# EAGLE design cgs_subosc (EAGLE 7.1.0)
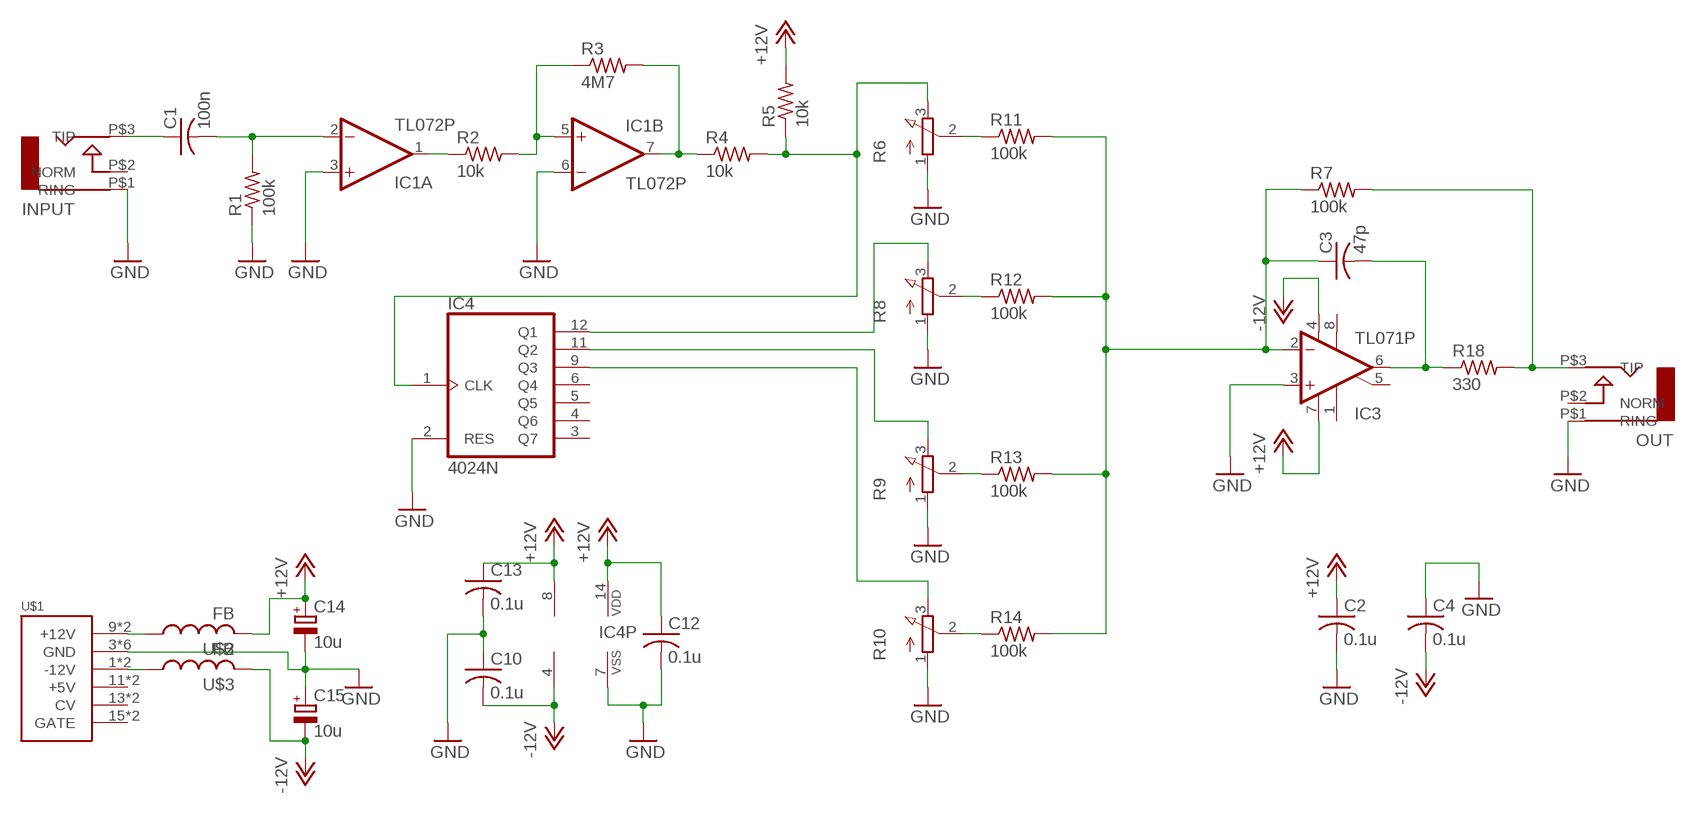
[diagram p0: schematic, sheet 1]

## Parts
C1  100n  C-US050-035X075  [C050-035X075]
C2  0.1u  C-US025-030X050  [C025-030X050]
C3  47p  C-US050-024X044  [C050-024X044]
C4  0.1u  C-US025-030X050  [C025-030X050]
C10  0.1u  C-US025-030X050  [C025-030X050]
C12  0.1u  C-US025-030X050  [C025-030X050]
C13  0.1u  C-US025-030X050  [C025-030X050]
C14  10u  CPOL-EUB45181A  [B45181A]
C15  10u  CPOL-EUB45181A  [B45181A]
IC1  TL072P  [DIL08]
IC3  TL071P  [DIL08]
IC4  4024N  [DIL14]
INPUT  AUDIO-JACK  [ERTHENVAR-JACK-90DEG]
OUT  AUDIO-JACK  [ERTHENVAR-JACK-90DEG]
R1  100k  R-US_0207/10  [0207/10]
R2  10k  R-US_0207/10  [0207/10]
R3  4M7  R-US_0207/10  [0207/10]
R4  10k  R-US_0207/10  [0207/10]
R5  10k  R-US_0207/10  [0207/10]
R6  3RP/1610N  [3RP/1610N]
R7  100k  R-US_0207/10  [0207/10]
R8  3RP/1610N  [3RP/1610N]
R9  3RP/1610N  [3RP/1610N]
R10  3RP/1610N  [3RP/1610N]
R11  100k  R-US_0207/10  [0207/10]
R12  100k  R-US_0207/10  [0207/10]
R13  100k  R-US_0207/10  [0207/10]
R14  100k  R-US_0207/10  [0207/10]
R18  330  R-US_0207/10  [0207/10]
U$1  POWER  [POWER_16]
U$2  FB  [FB]
U$3  FB  [FB]

## Nets
+12V: C2.1 C12.1 C13.1 C14.+ IC1.8(P:V+) IC3.7(V+) IC4.14(VDD) R5.2 U$2.P$2
-12V: C4.2 C10.2 C15.- IC1.4(P:V-) IC3.4(V-) U$3.P$2
GND: C2.2 C4.1 C10.1 C12.2 C13.2 C14.- C15.+ IC1.3(A:+IN) IC1.6(B:-IN) IC3.3(+IN) IC4.2(RES) IC4.7(VSS) INPUT.P$1(RING) OUT.P$1(RING) R1.1 R6.1(A) R8.1(A) R9.1(A) R10.1(A) U$1.3(GND) U$1.4(GND) U$1.5(GND) U$1.6(GND) U$1.7(GND) U$1.8(GND)
N$1: C1.1 INPUT.P$3(TIP)
N$2: C1.2 IC1.2(A:-IN) R1.2
N$3: IC1.5(B:+IN) R2.2 R3.1
N$4: C3.1 IC3.2(-IN) R7.1 R11.2 R12.2 R13.2 R14.2
N$5: IC1.7(B:OUT) R3.2 R4.1
N$7: IC1.1(A:OUT) R2.1
N$8: C3.2 IC3.6(OUT) R18.1
N$11: OUT.P$3(TIP) R7.2 R18.2
N$12: IC4.1(CLK) R4.2 R5.1 R6.3(E)
N$13: R6.2(S) R11.1
N$14: R8.2(S) R12.1
N$15: R9.2(S) R13.1
N$16: R10.2(S) R14.1
N$18: IC4.12(Q1) R8.3(E)
N$19: IC4.11(Q2) R9.3(E)
N$20: IC4.9(Q3) R10.3(E)
N$25: U$1.9(+12V) U$1.10(+12V) U$2.P$1
N$26: U$1.1(-12V) U$1.2(-12V) U$3.P$1
Unconnected: IC3.1(ON1) IC3.5(ON2) IC3.8(OPT) IC4.3(Q7) IC4.4(Q6) IC4.5(Q5) IC4.6(Q4) INPUT.P$2(NORM) OUT.P$2(NORM) U$1.11(+5V) U$1.12(+5V) U$1.13(CV) U$1.14(CV) U$1.15(GATE) U$1.16(GATE)

## Library data of the parts
C1-C4 C10 C12 C13 = rcl:C-US: CAPACITOR, American symbol
C14 C15 = rcl:CPOL-EU: POLARIZED CAPACITOR, European symbol
IC1 = linear:TL072: OP AMP
IC3 = linear:TL071: OP AMP
IC4 = 40xx:4024: 7-stage binary/ripple COUNTER
INPUT OUT = erthenvar:AUDIO-JACK: Switching Mono 3.5mm Audio Jack from Erthenvar.
R1-R5 R7 R11-R14 R18 = rcl:R-US_: RESISTOR, American symbol
R6 R8-R10 = pot:3RP/1610N: 16mm Potentiometer one level Source: http://www.alphapotentiometers.net/html/16mm_pot_2.html
U$1 = eurorack:POWER
U$2 U$3 = adafruit:FB: Ferrite bead Digikey #P9821BK-ND

## Board
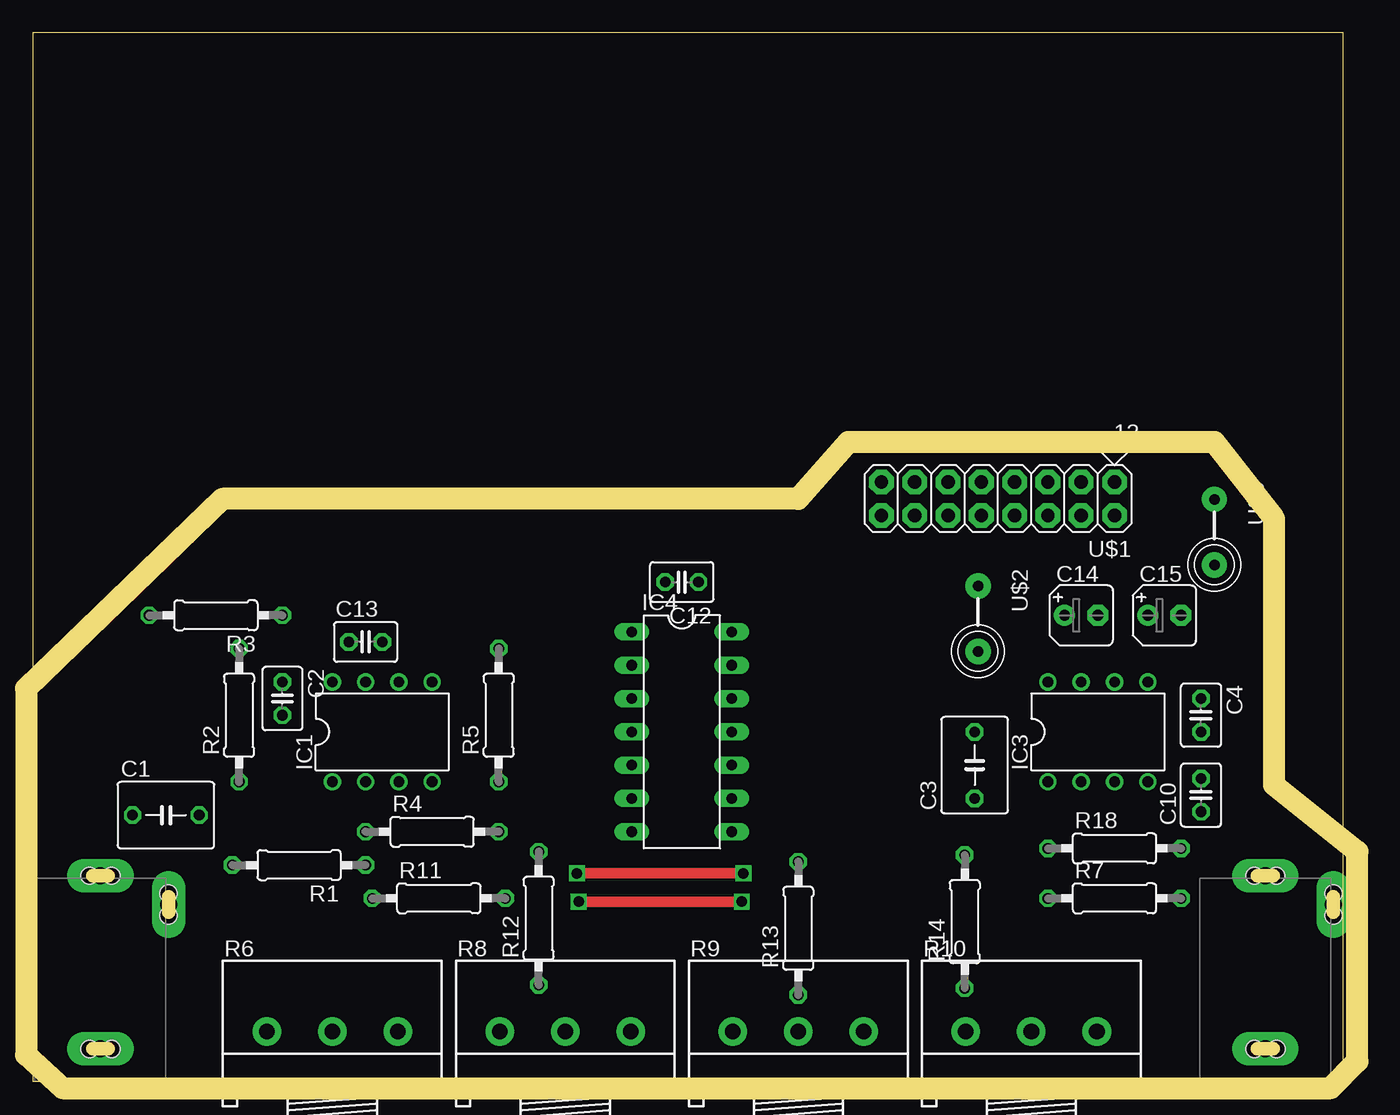
[diagram p1: board, top side]
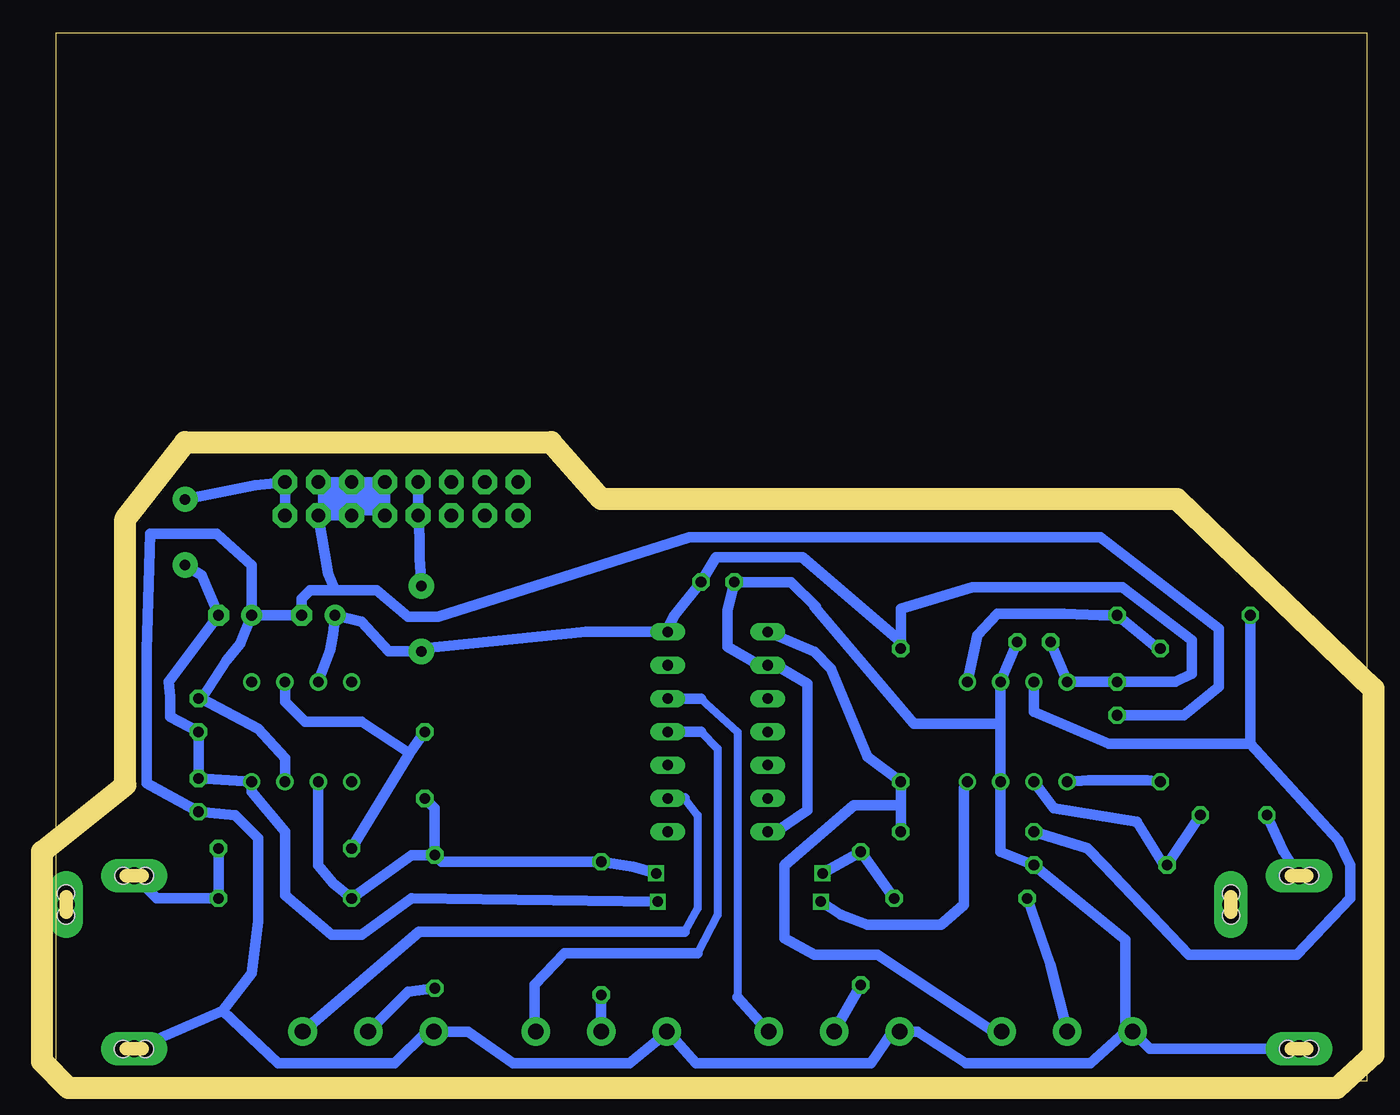
[diagram p2: board, bottom side, seen from below]

Size 100 x 80 mm. Coordinates in mm from the lower left corner, seen from the top.
Outline: 0,0 100,0 100,80 0,80 0,0
Copper layers (1*16): Top 0.035mm / dielectric 1.5mm / Bottom 0.035mm
Design rules "default *": minimum track width 28mil, minimum drill 31mil, track to track 16mil, track to pad 16mil, pad to pad 16mil, via to via 16mil, smd to smd 8mil, copper to edge 0mil, drill to drill 16mil, minimum pad ring 10mil, minimum via ring 8mil, stop-mask expansion 4mil, vias tented up to drill 0mil, thermal gap 10mil
Milling: 12 lines

### Footprints (pad centres in the part's own frame; a part is rotated, then mirrored left to right if it is on the bottom)
C050-050X075 = drill 0.813 octagon: 1 -2.54,0; 2 2.54,0
C025-030X050 = drill 0.813 octagon: 1 -1.27,0; 2 1.27,0
B45181A = drill 0.813 pad 1.6: + -1.27,0 | drill 0.813 pad 1.6 octagon: - 1.27,0
DIL08 = drill 0.813 pad 1.27: 1 -3.81,-3.81; 2 -1.27,-3.81; 3 1.27,-3.81; 4 3.81,-3.81; 5 3.81,3.81; 6 1.27,3.81; 7 -1.27,3.81; 8 -3.81,3.81
DIL14 = drill 0.813 long: 1 -7.62,-3.81; 2 -5.08,-3.81; 3 -2.54,-3.81; 4 0,-3.81; 5 2.54,-3.81; 6 5.08,-3.81; 7 7.62,-3.81; 8 7.62,3.81; 9 5.08,3.81; 10 2.54,3.81; 11 0,3.81; 12 -2.54,3.81; 13 -5.08,3.81; 14 -7.62,3.81
ERTHENVAR-JACK-90DEG = drill 1.3 pad 2.54 long: P$1 5,-2.5; P$2 -0.2,-13.5; P$3 5,-15.7 | hole 1.3: 5.842,-2.489; 4.14,-2.489; -0.203,-12.649; -0.203,-14.351; 5.842,-15.697; 4.166,-15.697
0207/10 = drill 0.813 octagon: 1 -5.08,0; 2 5.08,0
3RP/1610N = drill 1.2 pad 2.184: 1 -5,0; 2 0,0; 3 5,0
POWER_16 = drill 1.016 pad 1.88 octagon: 1 -6.35,-1.27; 2 -6.35,1.27; 3 -3.81,-1.27; 4 -3.81,1.27; 5 -1.27,-1.27; 6 -1.27,1.27; 7 1.27,-1.27; 8 1.27,1.27; 9 3.81,-1.27; 10 3.81,1.27; 11 6.35,-1.27; 12 6.35,1.27; 13 8.89,-1.27; 14 8.89,1.27; 15 11.43,-1.27; 16 11.43,1.27
FB = drill 0.8 pad 1.93: P$1 -2.5,0; P$2 2.5,0

### Placement (x,y rotation side)
C1  100n  [C050-050X075]  10.16,20.32 0 top
C2  19.05,29.21 270 top
C3  47p  [C050-050X075]  71.88,24.13 90 top
C4  89.15,27.94 270 top
C10  89.15,21.84 90 top
C12  49.53,38.1 180 top
C13  25.4,33.53 0 top
C14  80.01,35.56 0 top
C15  86.36,35.56 0 top
IC1  26.67,26.67 0 top
IC3  81.28,26.67 0 top
IC4  49.53,26.67 270 top
INPUT  10.16,0 180 top
OUT  99.06,0 180 top
R1  20.32,16.51 180 top
R2  15.75,27.94 90 top
R3  13.97,35.56 180 top
R4  30.48,19.05 0 top
R5  35.56,27.94 90 top
R6  22.86,3.81 0 top
R7  82.55,13.97 0 top
R8  40.64,3.81 0 top
R9  58.42,3.81 0 top
R10  76.2,3.81 0 top
R11  30.99,13.97 0 top
R12  38.61,12.45 90 top
R13  58.42,11.68 90 top
R14  71.12,12.19 90 top
R18  82.55,17.78 0 top
U$1  76.2,44.45 180 top
U$2  72.14,35.31 270 top
U$3  90.17,41.91 270 top

### Tracks (layer width: path | path; a pad name or v marks a point on that pad's centre or on a via)
+12V
  Bottom 0.813: IC3.7 79.12,32.89 78.87,34.16 C14.+ 76.71,35.05 74.64,32.81 U$2.P$2 72.26,33.02 59.56,34.29 53.47,34.29 | C13.1 IC1.8 C2.1 14.61,30.48 13.34,31.11 13.34,33.66 18.67,37.72 30.1,37.72 35.56,36.07 35.56,33.53 | 35.56,33.53 43.05,40.01 49.66,40.01 C12.1 52.83,35.56 53.47,34.29 | 53.47,34.29 IC4.14 | R5.2 35.56,33.53
-12V  (via drill 0.8)
  Top 0.813: v41.66,13.72 v54.1,13.72
  Bottom 0.813: U$3.P$2 90.17,39.37 88.9,38.61 C15.- 91.44,30.48 91.31,29.34 91.31,27.81 C4.2 C10.2 IC3.4 85.09,22.1 82.55,19.05 82.55,14.22 78.99,11.18 76.71,11.18 72.9,13.97 v54.1,13.72 | IC1.4 30.73,22.35 30.73,13.46 32.51,11.94 38.1,11.94 40.13,12.7 v41.66,13.72
GND
  Bottom 0.813: 88.9,29.21 84.58,26.92 82.55,24.64 IC3.3 | C4.1 88.9,29.21 | C2.2 13.97,27.94 11.3,30.1 11.3,34.54 20.32,41.53 51.69,41.53 70.87,35.43 73.15,35.43 75.56,37.47 78.74,37.47 | 78.74,37.47 80.64,37.47 81.28,36.83 C14.- C15.+ | 88.9,29.21 87,32.13 85.98,33.4 C15.+ | 87.31,5.4 83.06,1.4 74.17,1.4 71.75,3.81 R10.1 68.58,3.81 65.15,1.4 56.26,1.4 53.34,3.81 | 87.31,5.4 85.09,8.26 84.58,12.19 84.58,18.54 86.36,20.32 C10.1 93.09,22.73 93.09,32.89 92.84,41.78 87.76,41.78 85.09,39.37 C15.+ | 53.34,3.81 51.18,1.4 37.85,1.4 36.2,3.81 R8.1 34.29,3.81 30.61,1.4 21.08,1.4 18.41,3.81 | IC4.7 45.09,19.05 42.67,20.7 42.67,30.35 45.09,31.75 IC4.2 46.35,31.75 48.77,33.15 48.77,35.94 C12.2 43.94,38.1 42.04,36.2 42.16,36.2 34.54,27.3 27.94,27.3 | 27.94,27.3 IC1.3 27.94,17.53 R1.1 18.41,10.79 18.41,3.81 | 27.94,27.3 IC1.6 C13.2 | 18.41,3.81 R6.1 16.55,2.5 INPUT.P$1 | 53.34,3.81 R9.1 | OUT.P$1 94.06,2.46 87.31,5.4 | 78.74,37.47 79.25,38.73 U$1.4 U$1.6 U$1.5 | U$1.8 U$1.7 U$1.5 | U$1.3 U$1.5
N$1
  Bottom 0.813: C1.1 6.35,17.56 INPUT.P$3
N$2
  Bottom 0.813: C1.2 R1.2 15.49,16.51 17.53,19.81 23.88,20.83 IC1.2
N$3
  Bottom 0.813: IC1.5 29.72,34.04 28.19,35.69 23.11,35.69 20.32,35.56 R3.1 16.26,33.27 R2.2
N$4  (via drill 0.8)
  Top 0.813: v41.53,15.88 v54.23,15.88
  Bottom 0.813: R11.2 R12.2 v41.53,15.88 | IC3.2 80.01,16.51 78.87,15.11 R7.1 72.9,17.27 R14.2 | v54.23,15.88 56.01,16.38 R13.2 70.61,16.76 R14.2 | R14.2 71.12,20.83 C3.1
N$5
  Bottom 0.813: R4.1 21.34,17.78 20.07,16.51 13.59,9.65 5.33,9.65 1.27,13.97 1.27,16.51 2.16,18.41 8.89,25.78 | 8.89,25.78 19.68,25.78 25.4,28.19 IC1.7 | R3.2 8.89,25.78
N$7
  Bottom 0.813: R2.1 15.62,22.86 16.76,22.99 21.21,22.99 IC1.1
N$8
  Bottom 0.813: C3.2 73.03,25.02 | 73.03,25.02 R18.1 | 73.03,25.02 76.71,27.43 81.03,27.43 82.55,28.96 IC3.6
N$11
  Bottom 0.813: R18.2 R7.2 92.33,13.97 OUT.P$3
N$12
  Bottom 0.813: 35.56,21.08 R5.1 38.1,24.77 40.89,31.5 42.16,32.77 IC4.1 | 35.56,21.08 R4.2 | R6.3 28.45,3.81 37.34,9.65 42.16,9.65 44.45,10.92 44.45,16.51 39.12,21.08 35.56,21.08
N$13
  Bottom 0.813: R11.1 24.13,8.89 R6.2
N$14
  Bottom 0.813: R8.2 R12.1
N$15
  Bottom 0.813: R9.2 R13.1
N$16
  Bottom 0.813: R14.1 73.15,6.86 R10.2
N$18
  Bottom 0.61: 50.8,29.21 48.01,26.67 48.01,6.43
  Bottom 0.813: IC4.12 50.8,29.21 | 48.01,6.43 R8.3
N$19
  Bottom 0.61: 50.8,26.67 49.53,25.4 49.53,12.7 51.05,9.78
  Bottom 0.813: IC4.11 50.8,26.67 | 51.05,9.78 61.21,9.78 63.5,7.37 63.5,3.89 R9.3
N$20
  Bottom 0.61: 52.07,21.59 51.05,20.32 51.05,13.21 52.07,11.43
  Bottom 0.813: IC4.9 52.07,21.59 | 52.07,11.43 72.31,11.43 R10.3
N$25
  Bottom 0.813: U$1.9 U$1.10 72.26,41.53 72.26,39.88 U$2.P$1
N$26
  Bottom 0.813: U$1.2 U$1.1 84.84,45.47 U$3.P$1
(copper drawn outside any net)
  shapes: Bottom area x1